# Altium schematic sheet RF_ANT_Connector.SchDoc: RF ANT Connector
size A4
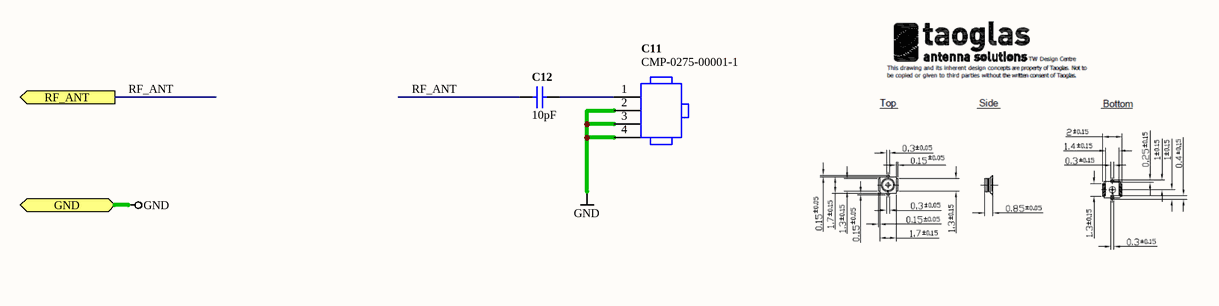
[diagram p0: RF_ANT_Connector.SchDoc]

## Parts
C11  CMP-0275-00001-1  [TG-RECE-20369-001E-4_V]
C12  value 10pF  [CAPC0402(1005)60_L]  (hidden comment: CAP 10pF 10V 0402(1005))

## Ports
GND, RF_ANT (out)

## Nets
GND: C11.2 C11.3 C11.4 ; port GND
RF_ANT: C12.1 ; port RF_ANT
NetC11_1: C11.1 C12.2

## Notes on the sheet
- Sheet Title
- Project Title
- Size:
- Date:
- A4
- Item:
- Time:
- Revision:
- Sheet
- of
- File:

## Library data of the parts
C11 = CMP-0275-00001-1: RF Connector, Onboard Receptacle, IPEX MHFIII; Manufacturer: Taoglas; PartNumber: RECE-20369-001E-01; Packing: Tape and Reel; Mounting Technology: Surface Mount; PackageReference: RECE-20369-001E-01-4; Housing Color: Gold; ComponentLink2URL: http://www.taoglas.com/images/product_images/original_images/RECE.20369.001E.01.pdf; ComponentLink3Description: Package Specification; PackageDescription: 4-Pin, Hand Drawn, Body 1.7x1.7mm; DatasheetVersion: Rev. C; ComponentLink1Description: Manufacturer URL; ComponentLink2Description: Datasheet; ComponentLink1URL: http://www.taoglas.com/; ComponentLink3URL: http://www.taoglas.com/images/product_images/original_images/RECE.20369.001E.01.pdf; PackageVersion: Rev. C
C12 = CMP-1034-00700-1: CAP 10pF 10V ±1% 0402 (1005 Metric) Thickness 0.6mm SMD; Case-Metric: 1005; Case-EIA: 0402; Technology: SMT; Max Thickness: 0.6 mm; Rated Voltage: 10 V; Tolerance: ±1%